# EAGLE schematic rc13-mbed-main-board2 (EAGLE 6.4)
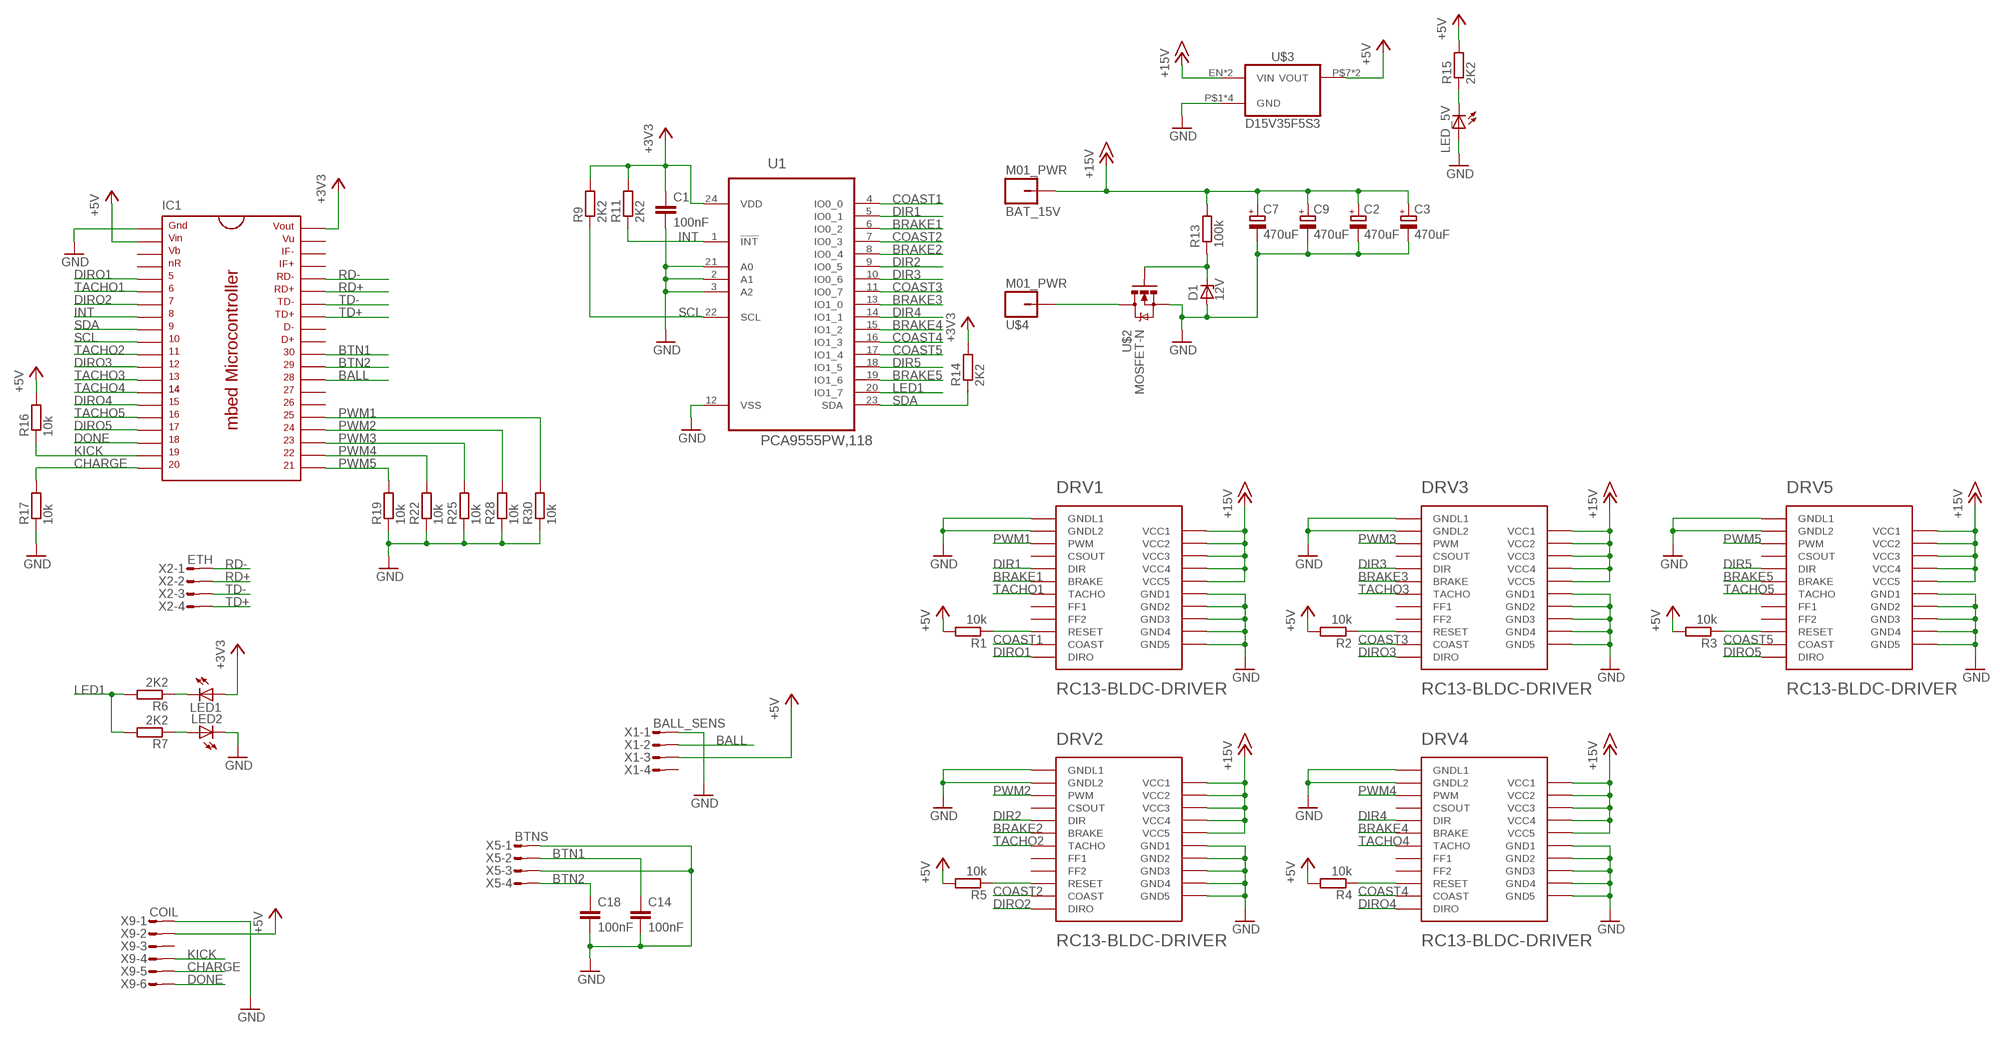
[diagram p0: schematic, sheet 1]

## Parts
BAT_15V  M01_PWR  [PWR_HOLE]
C1  100nF  C-EUC0603K  [C0603K]
C2  470uF  CPOL-EUE3.5-8  [E3,5-8]
C3  470uF  CPOL-EUE3.5-8  [E3,5-8]
C7  470uF  CPOL-EUE3.5-8  [E3,5-8]
C9  470uF  CPOL-EUE3.5-8  [E3,5-8]
C14  100nF  C-EUC0603K  [C0603K]
C18  100nF  C-EUC0603K  [C0603K]
D1  12V  ZENER-DIODESOD123  [SOD123]
DRV1  RC13-BLDC-DRIVER  [RC13-BLDC-DRIVER]
DRV2  RC13-BLDC-DRIVER  [RC13-BLDC-DRIVER]
DRV3  RC13-BLDC-DRIVER  [RC13-BLDC-DRIVER]
DRV4  RC13-BLDC-DRIVER  [RC13-BLDC-DRIVER]
DRV5  RC13-BLDC-DRIVER  [RC13-BLDC-DRIVER]
IC1  MBED_MICROCONTROLLER  [DIL40_0.9]
LED1  LEDCHIP-LED0603  [CHIP-LED0603]
LED2  LEDCHIP-LED0603  [CHIP-LED0603]
LED_5V  LEDCHIP-LED0603  [CHIP-LED0603]
R1  10k  R-EU_R0603  [R0603]
R2  10k  R-EU_R0603  [R0603]
R3  10k  R-EU_R0603  [R0603]
R4  10k  R-EU_R0603  [R0603]
R5  10k  R-EU_R0603  [R0603]
R6  2K2  R-EU_R0603  [R0603]
R7  2K2  R-EU_R0603  [R0603]
R9  2K2  R-EU_R0603  [R0603]
R11  2K2  R-EU_R0603  [R0603]
R13  100k  R-EU_R0603  [R0603]
R14  2K2  R-EU_R0603  [R0603]
R15  2K2  R-EU_R0603  [R0603]
R16  10k  R-EU_R0603  [R0603]
R17  10k  R-EU_R0603  [R0603]
R19  10k  R-EU_R0603  [R0603]
R22  10k  R-EU_R0603  [R0603]
R25  10k  R-EU_R0603  [R0603]
R28  10k  R-EU_R0603  [R0603]
R30  10k  R-EU_R0603  [R0603]
U1  PCA9555PW,118  [SOP65P640X110-24N]
U$2  MOSFET-N  MOSFET-N-SOT669  [TO127P600X120-5N]
U$3  D15V35F5S3  [D15V35F5S3]
U$4  M01_PWR  [PWR_HOLE]
X1  BALL_SENS  MICROMATCH-4  [MICROMATCH-4]
X2  ETH  MICROMATCH-4  [MICROMATCH-4]
X5  BTNS  MICROMATCH-4  [MICROMATCH-4]
X9  COIL  MICROMATCH-6  [MICROMATCH-6]

## Nets
+3V3: C1.1 IC1.40 LED1.A R9.2 R11.2 R14.2 U1.24(VDD)
+5V: IC1.2 R1.2 R2.2 R3.2 R4.2 R5.2 R15.2 R16.2 U$3.P$7(VOUT) U$3.P$8(VOUT) X1.3 X9.2
+15V: BAT_15V.P$1 C2.+ C3.+ C7.+ C9.+ DRV1.PWR1(VCC1) DRV1.PWR2(VCC2) DRV1.PWR3(VCC3) DRV1.PWR4(VCC4) DRV1.PWR5(VCC5) DRV2.PWR1(VCC1) DRV2.PWR2(VCC2) DRV2.PWR3(VCC3) DRV2.PWR4(VCC4) DRV2.PWR5(VCC5) DRV3.PWR1(VCC1) DRV3.PWR2(VCC2) DRV3.PWR3(VCC3) DRV3.PWR4(VCC4) DRV3.PWR5(VCC5) DRV4.PWR1(VCC1) DRV4.PWR2(VCC2) DRV4.PWR3(VCC3) DRV4.PWR4(VCC4) DRV4.PWR5(VCC5) DRV5.PWR1(VCC1) DRV5.PWR2(VCC2) DRV5.PWR3(VCC3) DRV5.PWR4(VCC4) DRV5.PWR5(VCC5) R13.2 U$3.EN(VIN) U$3.P$5(VIN)
BALL: IC1.28 X1.2
BAT_GND: U$2.5(D) U$4.P$1
BRAKE1: DRV1.LOGIC6(BRAKE) U1.6(IO0_2)
BRAKE2: DRV2.LOGIC6(BRAKE) U1.8(IO0_4)
BRAKE3: DRV3.LOGIC6(BRAKE) U1.13(IO1_0)
BRAKE4: DRV4.LOGIC6(BRAKE) U1.15(IO1_2)
BRAKE5: DRV5.LOGIC6(BRAKE) U1.19(IO1_6)
BTN1: C14.1 IC1.30 X5.2
BTN2: C18.1 IC1.29 X5.4
CHARGE: IC1.20 R17.2 X9.5
COAST1: DRV1.LOGIC11(COAST) U1.4(IO0_0)
COAST2: DRV2.LOGIC11(COAST) U1.7(IO0_3)
COAST3: DRV3.LOGIC11(COAST) U1.11(IO0_7)
COAST4: DRV4.LOGIC11(COAST) U1.16(IO1_3)
COAST5: DRV5.LOGIC11(COAST) U1.17(IO1_4)
DIR1: DRV1.LOGIC5(DIR) U1.5(IO0_1)
DIR2: DRV2.LOGIC5(DIR) U1.9(IO0_5)
DIR3: DRV3.LOGIC5(DIR) U1.10(IO0_6)
DIR4: DRV4.LOGIC5(DIR) U1.14(IO1_1)
DIR5: DRV5.LOGIC5(DIR) U1.18(IO1_5)
DIRO1: DRV1.LOGIC12(DIRO) IC1.5
DIRO2: DRV2.LOGIC12(DIRO) IC1.7
DIRO3: DRV3.LOGIC12(DIRO) IC1.12
DIRO4: DRV4.LOGIC12(DIRO) IC1.15
DIRO5: DRV5.LOGIC12(DIRO) IC1.17
DONE: IC1.18 X9.6
GND: C1.2 C2.- C3.- C7.- C9.- C14.2 C18.2 D1.A DRV1.LOGIC1(GNDL1) DRV1.LOGIC2(GNDL2) DRV1.PWR6(GND1) DRV1.PWR7(GND2) DRV1.PWR8(GND3) DRV1.PWR9(GND4) DRV1.PWR10(GND5) DRV2.LOGIC1(GNDL1) DRV2.LOGIC2(GNDL2) DRV2.PWR6(GND1) DRV2.PWR7(GND2) DRV2.PWR8(GND3) DRV2.PWR9(GND4) DRV2.PWR10(GND5) DRV3.LOGIC1(GNDL1) DRV3.LOGIC2(GNDL2) DRV3.PWR6(GND1) DRV3.PWR7(GND2) DRV3.PWR8(GND3) DRV3.PWR9(GND4) DRV3.PWR10(GND5) DRV4.LOGIC1(GNDL1) DRV4.LOGIC2(GNDL2) DRV4.PWR6(GND1) DRV4.PWR7(GND2) DRV4.PWR8(GND3) DRV4.PWR9(GND4) DRV4.PWR10(GND5) DRV5.LOGIC1(GNDL1) DRV5.LOGIC2(GNDL2) DRV5.PWR6(GND1) DRV5.PWR7(GND2) DRV5.PWR8(GND3) DRV5.PWR9(GND4) DRV5.PWR10(GND5) IC1.1 LED2.C LED_5V.A R17.1 R19.1 R22.1 R25.1 R28.1 R30.1 U1.2(A1) U1.3(A2) U1.12(VSS) U1.21(A0) U$2.1(S) U$2.2(S) U$2.3(S) U$3.P$1(GND) U$3.P$2(GND) U$3.P$3(GND) U$3.P$4(GND) X1.1 X5.1 X5.3 X9.1
INT: IC1.8 R11.1 U1.1(!INT)
KICK: IC1.19 R16.1 X9.4
LED1: R6.2 R7.2 U1.20(IO1_7)
N$2: DRV1.LOGIC10(RESET) R1.1
N$3: DRV2.LOGIC10(RESET) R5.1
N$4: DRV4.LOGIC10(RESET) R4.1
N$5: DRV5.LOGIC10(RESET) R3.1
N$6: DRV3.LOGIC10(RESET) R2.1
N$7: LED1.C R6.1
N$8: LED2.A R7.1
N$9: LED_5V.C R15.1
N$20: D1.C R13.1 U$2.4(G)
PWM1: DRV1.LOGIC3(PWM) IC1.25 R30.2
PWM2: DRV2.LOGIC3(PWM) IC1.24 R28.2
PWM3: DRV3.LOGIC3(PWM) IC1.23 R25.2
PWM4: DRV4.LOGIC3(PWM) IC1.22 R22.2
PWM5: DRV5.LOGIC3(PWM) IC1.21 R19.2
RD+: IC1.35 X2.2
RD-: IC1.36 X2.1
SCL: IC1.10 R9.1 U1.22(SCL)
SDA: IC1.9 R14.1 U1.23(SDA)
TACHO1: DRV1.LOGIC7(TACHO) IC1.6
TACHO2: DRV2.LOGIC7(TACHO) IC1.11
TACHO3: DRV3.LOGIC7(TACHO) IC1.13
TACHO4: DRV4.LOGIC7(TACHO) IC1.14
TACHO5: DRV5.LOGIC7(TACHO) IC1.16
TD+: IC1.33 X2.4
TD-: IC1.34 X2.3
Unconnected: DRV1.LOGIC4(CSOUT) DRV1.LOGIC8(FF1) DRV1.LOGIC9(FF2) DRV2.LOGIC4(CSOUT) DRV2.LOGIC8(FF1) DRV2.LOGIC9(FF2) DRV3.LOGIC4(CSOUT) DRV3.LOGIC8(FF1) DRV3.LOGIC9(FF2) DRV4.LOGIC4(CSOUT) DRV4.LOGIC8(FF1) DRV4.LOGIC9(FF2) DRV5.LOGIC4(CSOUT) DRV5.LOGIC8(FF1) DRV5.LOGIC9(FF2) IC1.3 IC1.4 IC1.26 IC1.27 IC1.31 IC1.32 IC1.37 IC1.38 IC1.39 X1.4 X9.3

## Library data of the parts
BAT_15V U$4 = tellis2:M01_PWR
C1 C14 C18 = rcl:C-EU: CAPACITOR, European symbol
C2 C3 C7 C9 = rcl:CPOL-EU: POLARIZED CAPACITOR, European symbol
D1 = diode:ZENER-DIODE: Z-Diode
DRV1-DRV5 = rc13-bldc-driver:RC13-BLDC-DRIVER
IC1 = mbed-microcontroller:MBED_MICROCONTROLLER: mbed Microcontroller, DIP40, 0.9"
LED1 LED2 LED_5V = led:LED: LED OSRAM: - CHIPLED LG R971, LG N971, LY N971, LG Q971, LY Q971, LO R971, LY R971 LH N974, LH R974 LS Q976, LO Q976, LY Q976 LO Q996 - Hyper CHIPLED LW Q18S LB Q993, LB Q99A, LB R99A - SideLED LS A670, LO A670, LY A670, LG A670, LP A670 LB A673, LV A673, LT A673, LW A673 LH A674 LY A675 LS A676, LA A676, LO A676, LY A676, LW A676 LS A679, LY A679, LG A679 - Hyper Micro SIDELED® LS Y876, LA Y876, LO Y876, LY Y876 LT Y87S - SmartLED LW L88C, LW L88S LB L89C, LB L89S, LG L890 LS L89K, LO L89K, LY L89K LS L896, LA L896, LO L896, LY L896 - TOPLED LS T670, LO T670, LY T670, LG T670, LP T670 LSG T670, LSP T670, LSY T670, LOP T670, LYG T670 LG T671, LOG T671, LSG T671 LB T673, LV T673, LT T673, LW T673 LH T674 LS T676, LA T676, LO T676, LY T676, LB T676, LH T676, LSB T676, LW T676 LB T67C, LV T67C, LT T67C, LS T67K, LO T67K, LY T67K, LW E67C LS E67B, LA E67B, LO E67B, LY E67B, LB E67C, LV E67C, LT E67C LW T67C LS T679, LY T679, LG T679 LS T770, LO T770, LY T770, LG T770, LP T770 LB T773, LV T773, LT T773, LW T773 LH T774 LS E675, LA E675, LY E675, LS T675 LS T776, LA T776, LO T776, LY T776, LB T776 LHGB T686 LT T68C, LB T68C - Hyper Mini TOPLED® LB M676 - Mini TOPLED Santana® LG M470 LS M47K, LO M47K, LY M47K Source: http://www.osram.convergy.de LUXEON: - LUMILED® LXK2-PW12-R00, LXK2-PW12-S00, LXK2-PW14-U00, LXK2-PW14-V00 LXK2-PM12-R00, LXK2-PM12-S00, LXK2-PM14-U00 LXK2-PE12-Q00, LXK2-PE12-R00, LXK2-PE12-S00, LXK2-PE14-T00, LXK2-PE14-U00 LXK2-PB12-K00, LXK2-PB12-L00, LXK2-PB12-M00, LXK2-PB14-N00, LXK2-PB14-P00, LXK2-PB14-Q00 LXK2-PR12-L00, LXK2-PR12-M00, LXK2-PR14-Q00, LXK2-PR14-R00 LXK2-PD12-Q00, LXK2-PD12-R00, LXK2-PD12-S00 LXK2-PH12-R00, LXK2-PH12-S00 LXK2-PL12-P00, LXK2-PL12-Q00, LXK2-PL12-R00 Source: www.luxeon.com KINGBRIGHT: KA-3528ASYC Source: www.kingbright.com
R1-R7 R9 R11 R13-R17 R19 R22 R25 R28 R30 = rcl:R-EU_: RESISTOR, European symbol
U1 = PCA9555:PCA9555PW,118: IC, I/O EXPANDER, 16BIT, 24TSSOP; MPN: PCA9555PW,118; OC_FARNELL: 2101299; OC_NEWARK: 70R6680; PACKAGE: 24TSSOP; SUPPLIER: NXP
U$2 = nxp_sot669:MOSFET-N-SOT669
U$3 = D15V35F5S3:D15V35F5S3
X1 X2 X5 = con-amp-micromatch:MICROMATCH-4: MicroMaTch 4 7-215464-4 / 0-215464-4 Drawing Number C-215464 DDEController.pdf; MPN: 7-215464-4; OC_FARNELL: 3784629; OC_NEWARK: 19R8124
X9 = con-amp-micromatch:MICROMATCH-6: MicroMaTch 6 7-215464-6 / 0-215464-6 Drawing Number C-215464 DDEController.pdf; MPN: 7-215464-6; OC_FARNELL: 3784630; OC_NEWARK: 19R8125